# Altium schematic sheet ethernet.SchDoc
size A3; Organization: Develer s.r.l.; Address1: via Mugellese 1/A; Address2: 50019 Campi Bisenzio; Address3: Firenze; Address4: ITALY; Revision: A; SheetNumber: 1; SheetTotal: 1
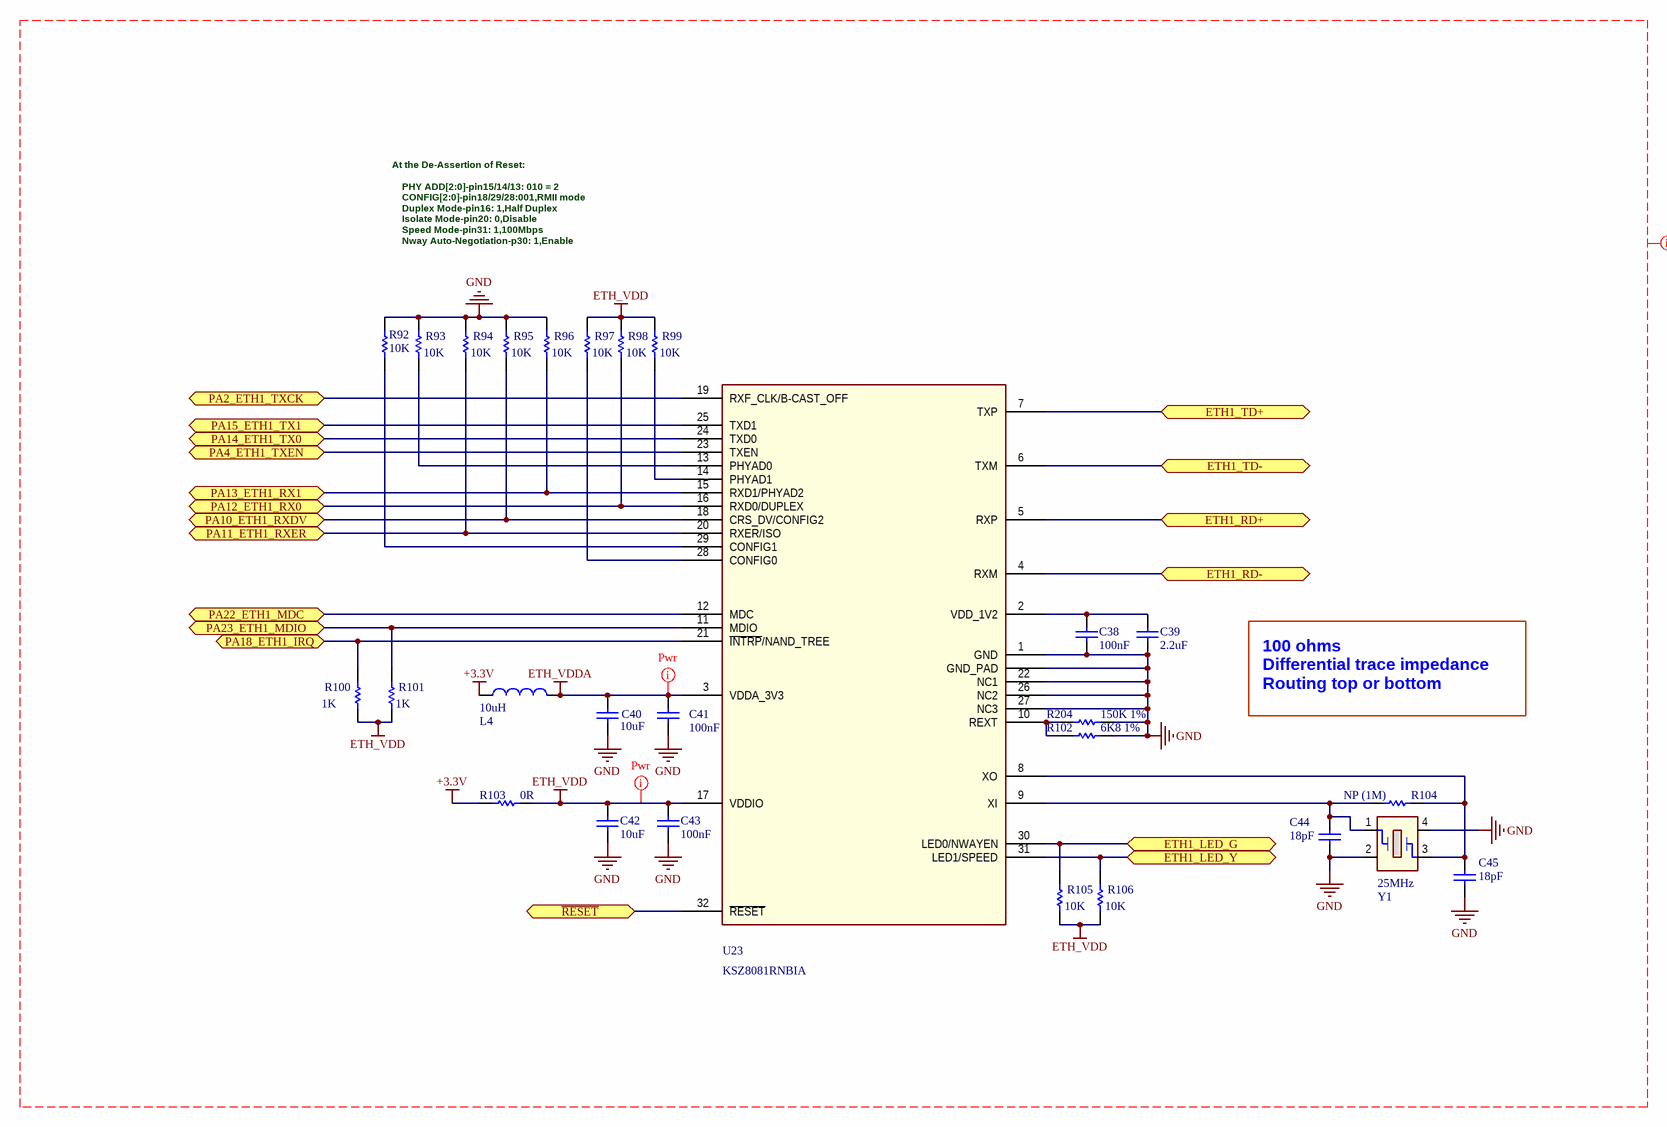
[diagram p0: ethernet.SchDoc]

## Parts
C38  100nF  [0603_[1608]]
C39  2.2uF  [0603_[1608]]
C40  10uF  [1206_[3216]]
C41  100nF  [0603_[1608]]
C42  10uF  [1206_[3216]]
C43  100nF  [0603_[1608]]
C44  18pF  [0603_[1608]]
C45  18pF  [0603_[1608]]
L4  10uH  [0603_[1608]]
R92  10K  [0603_[1608]]
R93  10K  [0603_[1608]]
R94  10K  [0603_[1608]]
R95  10K  [0603_[1608]]
R96  10K  [0603_[1608]]
R97  10K  [0603_[1608]]
R98  10K  [0603_[1608]]
R99  10K  [0603_[1608]]
R100  1K  [0603_[1608]]
R101  1K  [0603_[1608]]
R102  6K8 1%  [0603_[1608]]
R103  0R  [0603_[1608]]
R104  NP (1M)  [0603_[1608]]
R105  10K  [0603_[1608]]
R106  10K  [0603_[1608]]
R204  150K 1%  [0603_[1608]]
U23  KSZ8081RNBIA  [QFN-32]
Y1  25MHz  [CRYSTAL_3.2X2.5MM_4P_SMD]

## Ports
ETH1_LED_G, ETH1_LED_Y, ETH1_RD+, ETH1_RD-, ETH1_TD+, ETH1_TD-, PA2_ETH1_TXCK, PA4_ETH1_TXEN, PA10_ETH1_RXDV, PA11_ETH1_RXER, PA12_ETH1_RX0, PA13_ETH1_RX1, PA14_ETH1_TX0, PA15_ETH1_TX1, PA18_ETH1_IRQ, PA22_ETH1_MDC, PA23_ETH1_MDIO, ~{RESET}

## Nets
+3.3V: L4.1 R103.2
ETH_VDD: C42.2 C43.2 R97.1 R98.1 R99.1 R100.2 R101.2 R103.1 R105.2 R106.2 U23.17(VDDIO)
ETH_VDDA: C40.2 C41.2 L4.2 U23.3(VDDA_3V3)
GND: C38.1 C39.1 C40.1 C41.1 C42.1 C43.1 C44.1 C45.1 R92.2 R93.1 R94.1 R95.1 R96.1 R102.2 R204.2 U23.1(GND) U23.22(NC1) U23.26(NC2) U23.27(NC3) U23.GND_PAD Y1.2 Y1.4
~{RESET}: U23.32(~{RESET}) ; port ~{RESET}
ETH1_LED_G: R105.1 U23.30(LED0/NWAYEN) ; port ETH1_LED_G
ETH1_LED_Y: R106.1 U23.31(LED1/SPEED) ; port ETH1_LED_Y
ETH1_RD+: U23.5(RXP) ; port ETH1_RD+
ETH1_RD-: U23.4(RXM) ; port ETH1_RD-
ETH1_TD+: U23.7(TXP) ; port ETH1_TD+
ETH1_TD-: U23.6(TXM) ; port ETH1_TD-
PA2_ETH1_TXCK: U23.19(RXF_CLK/B-CAST_OFF) ; port PA2_ETH1_TXCK
PA4_ETH1_TXEN: U23.23(TXEN) ; port PA4_ETH1_TXEN
PA10_ETH1_RXDV: R95.2 U23.18(CRS_DV/CONFIG2) ; port PA10_ETH1_RXDV
PA11_ETH1_RXER: R94.2 U23.20(RXER/ISO) ; port PA11_ETH1_RXER
PA12_ETH1_RX0: R98.2 U23.16(RXD0/DUPLEX) ; port PA12_ETH1_RX0
PA13_ETH1_RX1: R96.2 U23.15(RXD1/PHYAD2) ; port PA13_ETH1_RX1
PA14_ETH1_TX0: U23.24(TXD0) ; port PA14_ETH1_TX0
PA15_ETH1_TX1: U23.25(TXD1) ; port PA15_ETH1_TX1
PA18_ETH1_IRQ: R100.1 U23.21(~{INTRP}/NAND_TREE) ; port PA18_ETH1_IRQ
PA22_ETH1_MDC: U23.12(MDC) ; port PA22_ETH1_MDC
PA23_ETH1_MDIO: R101.1 U23.11(MDIO) ; port PA23_ETH1_MDIO
NetC38_2: C38.2 C39.2 U23.2(VDD_1V2)
NetC44_2: C44.2 R104.2 U23.9(XI) Y1.1
NetC45_2: C45.2 R104.1 U23.8(XO) Y1.3
NetR92_1: R92.1 U23.29(CONFIG1)
NetR93_2: R93.2 U23.13(PHYAD0)
NetR97_2: R97.2 U23.28(CONFIG0)
NetR99_2: R99.2 U23.14(PHYAD1)
NetR102_1: R102.1 R204.1 U23.10(REXT)

## Layout directives
net class Power: ETH_VDD, ETH_VDDA
net class Eth: +3.3V, ETH_VDD, ETH_VDDA, GND

## Notes on the sheet
- At the De-Assertion of Reset:
  PHY ADD[2:0]-pin15/14/13: 010 = 2
  CONFIG[2:0]-pin18/29/28:001,RMII mode
  Duplex Mode-pin16: 1,Half Duplex
  Isolate Mode-pin20: 0,Disable
  Speed Mode-pin31: 1,100Mbps
  Nway Auto-Negotiation-p30: 1,Enable
- 100 ohms
  Differential trace impedance
  Routing top or bottom
- Title:
- Size:
- Rev:
- A3
- Author:
- Approved:
- File:
- Date:
- Time:
- Sheet
- of

## Library data of the parts
C38 C41 C43 = Cap: Ceramic X7R 50V; Value: 10nF; Published: 8-Jun-2000; Revision: July-2002: Re-released for DXP Platform.; Publisher: Altium Limited
C39 = Cap: Ceramic X7R, X5R 6.3V; Value: 10nF; Published: 8-Jun-2000; Revision: July-2002: Re-released for DXP Platform.; Publisher: Altium Limited
C40 C42 = Cap: Ceramic X5R 25V; Value: 10nF; Published: 8-Jun-2000; Revision: July-2002: Re-released for DXP Platform.; Publisher: Altium Limited
C44 C45 = Cap: Ceraminc C0G/NP0 50V; Value: 10nF; Published: 8-Jun-2000; Revision: July-2002: Re-released for DXP Platform.; Publisher: Altium Limited
L4 = Inductor: Inductor (MLZ1608N100L); Code_IEC: 1005; Value: 10mH; Published: 8-Jun-2000; LatestRevisionDate: 29-May-2009; LatestRevisionNote: IPC-7351 Footprint Added.; PackageReference: 0402-A; Publisher: Altium Limited; PackageDescription: Chip Inductor; Code_JEITA: 0402
R92-R99 R102-R106 R204 = Res1: Resistor; Value: 1K; Published: 8-Jun-2000; Revision: July-2002: Re-released for DXP Platform.; Publisher: Altium Limited
R100 R101 = Res1: Resistor; Published: 8-Jun-2000; Revision: July-2002: Re-released for DXP Platform.; Publisher: Altium Limited; Value: 1K
U23 = KSZ8081RNB: Ethernet PHY
Y1 = XTAL_13Y_A: Crystal, Temperature -40C to +85C; CLASS: IC